# EAGLE schematic EEZ DIB AFE3 r1B1 (EAGLE 7.2.0)
2 x isolated, Hi-voltage, Hi-current
Assembly variants: Farnell, TME

## Sheet 1 of 4: Isolated Ch#1, Ch#2
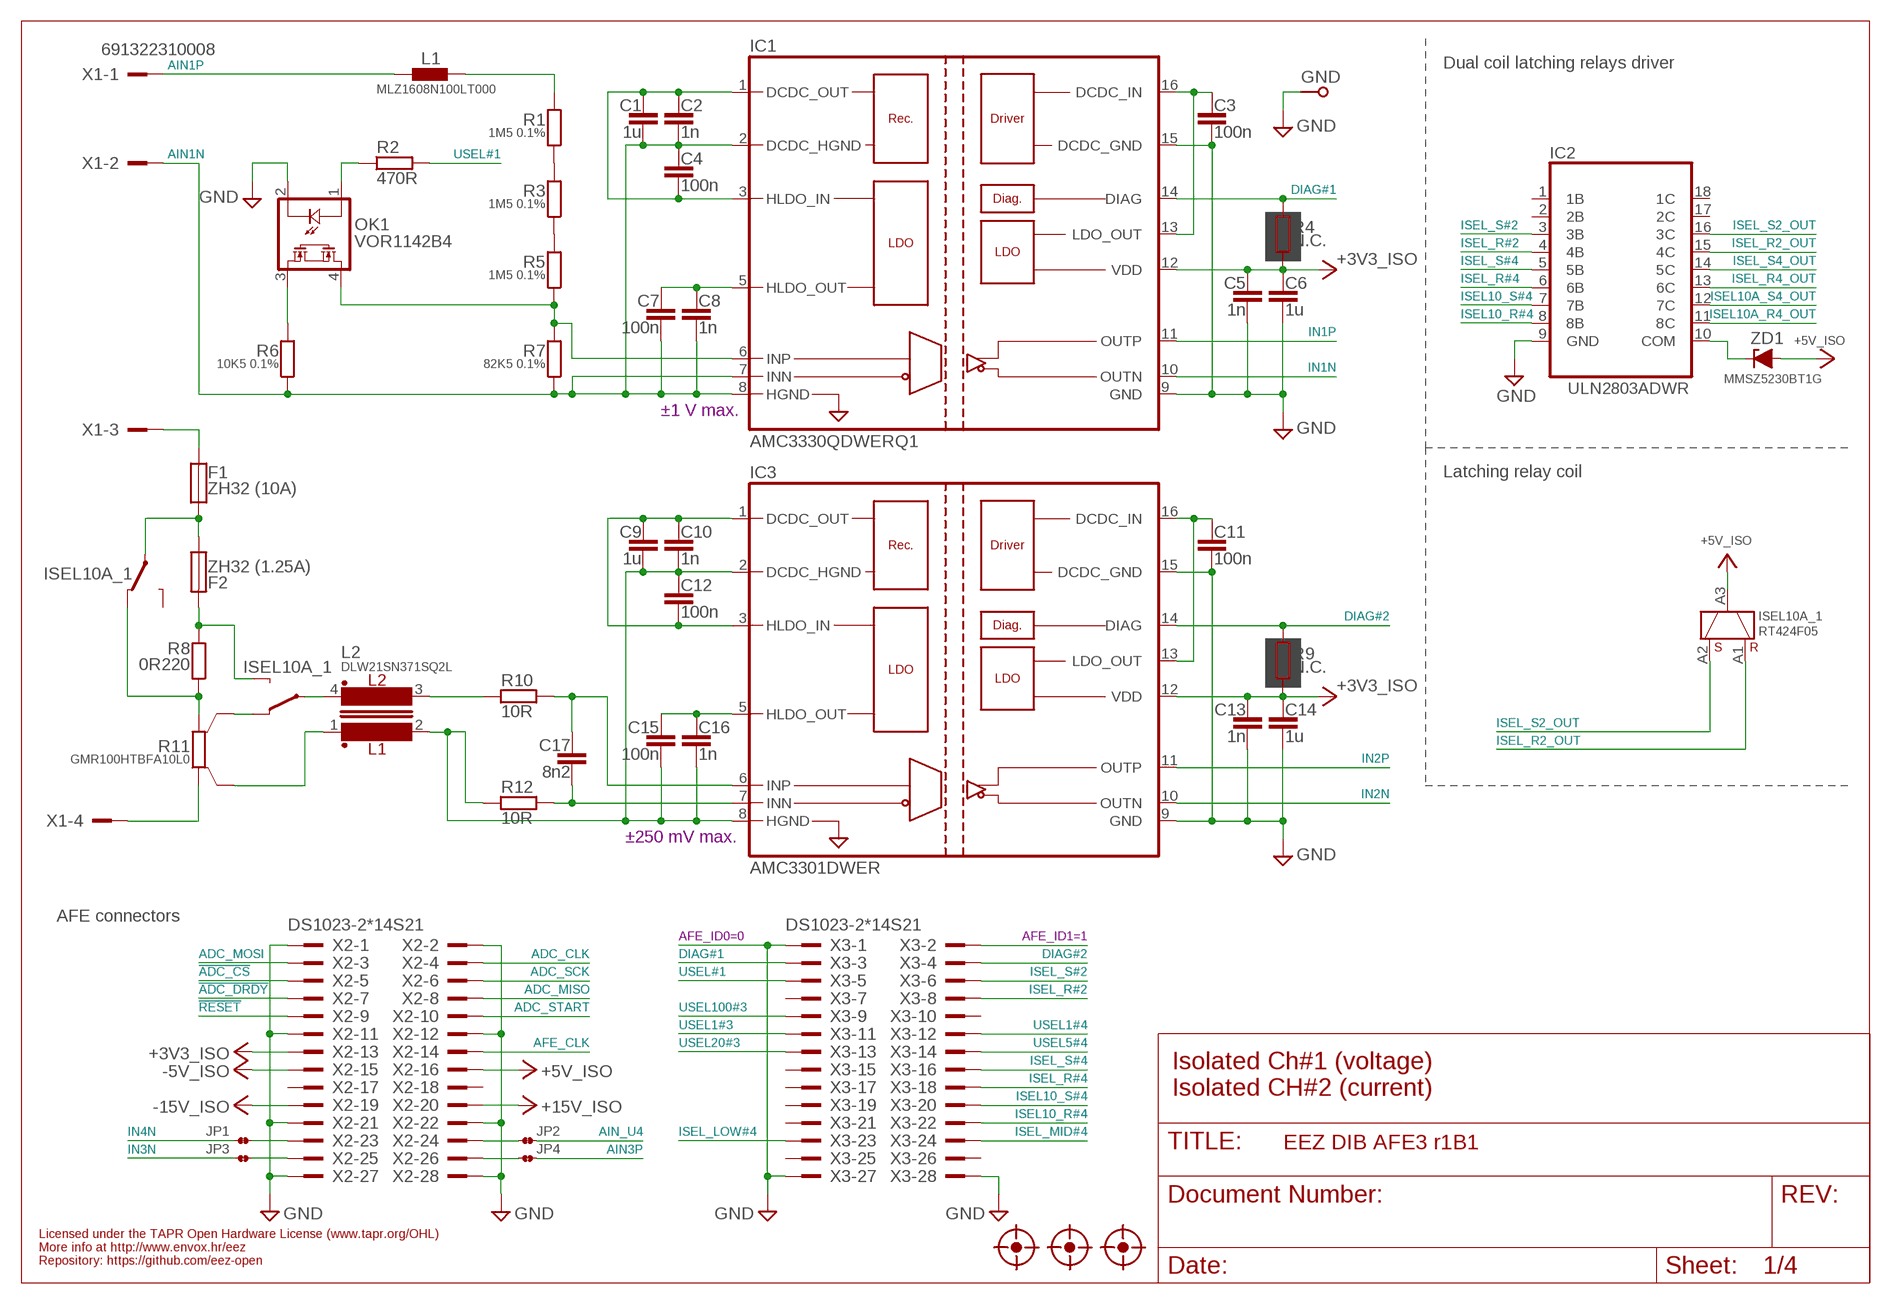
[diagram p0: schematic, sheet 1]

### Parts
C1  1u  C-EUC0603  [C0603]
C2  1n  C-EUC0603  [C0603]
C3  100n  C-EUC0603  [C0603]
C4  100n  C-EUC0603  [C0603]
C5  1n  C-EUC1206  [C1206]
C6  1u  C-EUC1206  [C1206]
C7  100n  C-EUC1206  [C1206]
C8  1n  C-EUC1206  [C1206]
C9  1u  C-EUC0603  [C0603]
C10  1n  C-EUC0603  [C0603]
C11  100n  C-EUC0603  [C0603]
C12  100n  C-EUC0603  [C0603]
C13  1n  C-EUC1206  [C1206]
C14  1u  C-EUC1206  [C1206]
C15  100n  C-EUC1206  [C1206]
C16  1n  C-EUC1206  [C1206]
C17  8n2  C-EUC0603  [C0603]
F1  ZH32 (10A)  ZH32  [ZH32]
F2  ZH32 (1.25A)  ZH32  [ZH32]
FM1  FIDUCIAL_2  [FIDUCIAL_DUAL]
FM2  FIDUCIAL_2  [FIDUCIAL_DUAL]
FM3  FIDUCIAL_2  [FIDUCIAL_DUAL]
GND  PCB_TEST_TABSHIELD  [PCB_SHIELD_TAB]
IC1  AMC3330QDWERQ1  AMC3301DWER  [DW16]
IC2  ULN2803ADWR  [DW18_TEX-M]
IC3  AMC3301DWER  [DW16]
ISEL10A_1  RT424F05  RT424FXX  [RT424FXX]
JP1  JP2-NOCUT-0805  [JP2-0805-NOCUT]
JP2  JP2-NOCUT-0805  [JP2-0805-NOCUT]
JP3  JP2-NOCUT-0805  [JP2-0805-NOCUT]
JP4  JP2-NOCUT-0805  [JP2-0805-NOCUT]
L1  MLZ1608N100LT000  FERRITE_BEAD0603  [BEAD0603]
L2  DLW21SN371SQ2L  DLW21S  [MURATA_DLW21S]
OK1  VOR1142B4  [DIL4-SMD]
R1  1M5 0.1%  R-EU_R1206  [R1206]
R2  470R  R-EU_R0805  [R0805]
R3  1M5 0.1%  R-EU_R1206  [R1206]
R4  N.C.  R-EU_R0805  [R0805]
R5  1M5 0.1%  R-EU_R1206  [R1206]
R6  10K5 0.1%  R-EU_R1206  [R1206]
R7  82K5 0.1%  R-EU_R1206  [R1206]
R8  0R220  R-EU_R1210  [R1210]
R9  N.C.  R-EU_R0805  [R0805]
R10  10R  R-EU_R0805  [R0805]
R11  GMR100HTBFA10L0  R-EU_4WIRE2512  [R_2512-4WIRE]
R12  10R  R-EU_R0805  [R0805]
X1  691322310008  [691322310008]
X2  DS1023-2*14S21  TSW-114-07-F-D  [TSW-114-07-F-D]
X3  DS1023-2*14S21  TSW-114-07-F-D  [TSW-114-07-F-D]
ZD1  MMSZ5230BT1G  ZENER-DIODESOD123  [SOD123]

### Nets
!ADC_CS: X2.5 ; also sheet 4
!ADC_DRDY: X2.7 ; also sheet 4
!RESET: X2.9 ; also sheet 4
+3V3_ISO: C5.1 C6.1 C13.1 C14.1 IC1.12(VDD) IC3.12(VDD) R4.2 R9.2 X2.13 ; also sheet 4
+5V_ISO: ISEL10A_1.A3(A:COM) X2.16 ZD1.A ; also sheet 2,3,4
+15V_ISO: X2.20 ; also sheet 2,3
-5V_ISO: X2.15 ; also sheet 4
-15V_ISO: X2.19 ; also sheet 2,3
ADC_CLK: X2.4 ; also sheet 4
ADC_MISO: X2.8 ; also sheet 4
ADC_MOSI: X2.3 ; also sheet 4
ADC_SCK: X2.6 ; also sheet 4
ADC_START: X2.10 ; also sheet 4
AFE_CLK: X2.14
AIN1N: C1.2 C2.2 C4.1 C7.2 C8.2 IC1.2(DCDC_HGND) IC1.7(INN) IC1.8(HGND) R6.1 R7.1 X1.2
AIN1P: L1.P$2 X1.1
AIN2N: R11.1 X1.4
AIN2P: F1.2 X1.3
AIN3P: JP4.2 ; also sheet 2
AIN_U4: JP2.2 ; also sheet 3
DIAG#1: IC1.14(DIAG) R4.1 X3.3
DIAG#2: IC3.14(DIAG) R9.1 X3.4
GND: C3.2 C5.2 C6.2 C11.2 C13.2 C14.2 GND.1 IC1.9(GND) IC1.15(DCDC_GND) IC2.9(GND) IC3.9(GND) IC3.15(DCDC_GND) OK1.2(C) X2.1 X2.2 X2.11 X2.12 X2.21 X2.22 X2.27 X2.28 X3.1 X3.27 X3.28 ; also sheet 2,3,4
GNDI1: C9.2 C10.2 C12.1 C15.2 C16.2 IC3.2(DCDC_HGND) IC3.8(HGND) L2.2 R12.2
IN1N: IC1.10(OUTN) ; also sheet 4
IN1P: IC1.11(OUTP) ; also sheet 4
IN2N: IC3.10(OUTN) ; also sheet 4
IN2P: IC3.11(OUTP) ; also sheet 4
IN3N: JP3.1 ; also sheet 2,4
IN4N: JP1.1 ; also sheet 3,4
ISEL10_R#4: IC2.8(8B) X3.22
ISEL10_S#4: IC2.7(7B) X3.20
ISEL10A_R4_OUT: IC2.11(8C) ; also sheet 3
ISEL10A_S4_OUT: IC2.12(7C) ; also sheet 3
ISEL_LOW#4: X3.23 ; also sheet 3
ISEL_MID#4: X3.24 ; also sheet 3
ISEL_R2_OUT: IC2.15(4C) ISEL10A_1.A1(A:R)
ISEL_R4_OUT: IC2.13(6C) ; also sheet 3
ISEL_R#2: IC2.4(4B) X3.8
ISEL_R#4: IC2.6(6B) X3.18
ISEL_S2_OUT: IC2.16(3C) ISEL10A_1.A2(A:S)
ISEL_S4_OUT: IC2.14(5C) ; also sheet 3
ISEL_S#2: IC2.3(3B) X3.6
ISEL_S#4: IC2.5(5B) X3.16
N$2: L1.P$1 R1.2
N$6: X3.2
N$15: IC1.6(INP) OK1.4(S1) R5.1 R7.2
N$16: R1.1 R3.2
N$17: R3.1 R5.2
N$18: ISEL10A_1.22(C:NC) R11.2S
N$19: ISEL10A_1.12(B:NC) R8.1 R11.2
N$20: OK1.3(S2) R6.2
N$21: C1.1 C2.1 C4.2 IC1.1(DCDC_OUT) IC1.3(HLDO_IN)
N$25: C7.1 C8.1 IC1.5(HLDO_OUT)
N$28: C3.1 IC1.13(LDO_OUT) IC1.16(DCDC_IN)
N$29: C17.1 IC3.6(INP) R10.1
N$31: C9.1 C10.1 C12.2 IC3.1(DCDC_OUT) IC3.3(HLDO_IN)
N$32: C15.1 C16.1 IC3.5(HLDO_OUT)
N$33: C11.1 IC3.13(LDO_OUT) IC3.16(DCDC_IN)
N$37: ISEL10A_1.21(C:COM) L2.4
N$44: F1.1 F2.1 ISEL10A_1.11(B:COM)
N$55: L2.1 R11.1S
N$71: F2.2 ISEL10A_1.24(C:NO) R8.2
N$73: OK1.1(A) R2.1
N$75: L2.3 R10.2
N$77: C17.2 IC3.7(INN) R12.1
N$137: IC2.10(COM) ZD1.C
N$154: JP1.2 X2.23
N$155: JP3.2 X2.25
N$156: JP2.1 X2.24
N$157: JP4.1 X2.26
USEL1#3: X3.11 ; also sheet 2
USEL1#4: X3.12 ; also sheet 3
USEL5#4: X3.14 ; also sheet 3
USEL20#3: X3.13 ; also sheet 2
USEL100#3: X3.9 ; also sheet 2
USEL#1: R2.2 X3.5
Unconnected: IC2.1(1B) IC2.2(2B) IC2.17(2C) IC2.18(1C) ISEL10A_1.14(B:NO) X2.17 X2.18 X3.7 X3.10 X3.15 X3.17 X3.19 X3.21 X3.25 X3.26

### Notes on the sheet
- Dual coil latching relays driver
- ±1 V max.
- Latching relay coil
- ±250 mV max.
- AFE connectors
- AFE_ID0=0 | AFE_ID1=1
- Isolated Ch#1 (voltage)
  Isolated CH#2 (current)
- Licensed under the TAPR Open Hardware License (www.tapr.org/OHL)
- More info at http://www.envox.hr/eez
- Repository: https://github.com/eez-open

## Sheet 2 of 4: AFE Ch#3 (hi-voltage)
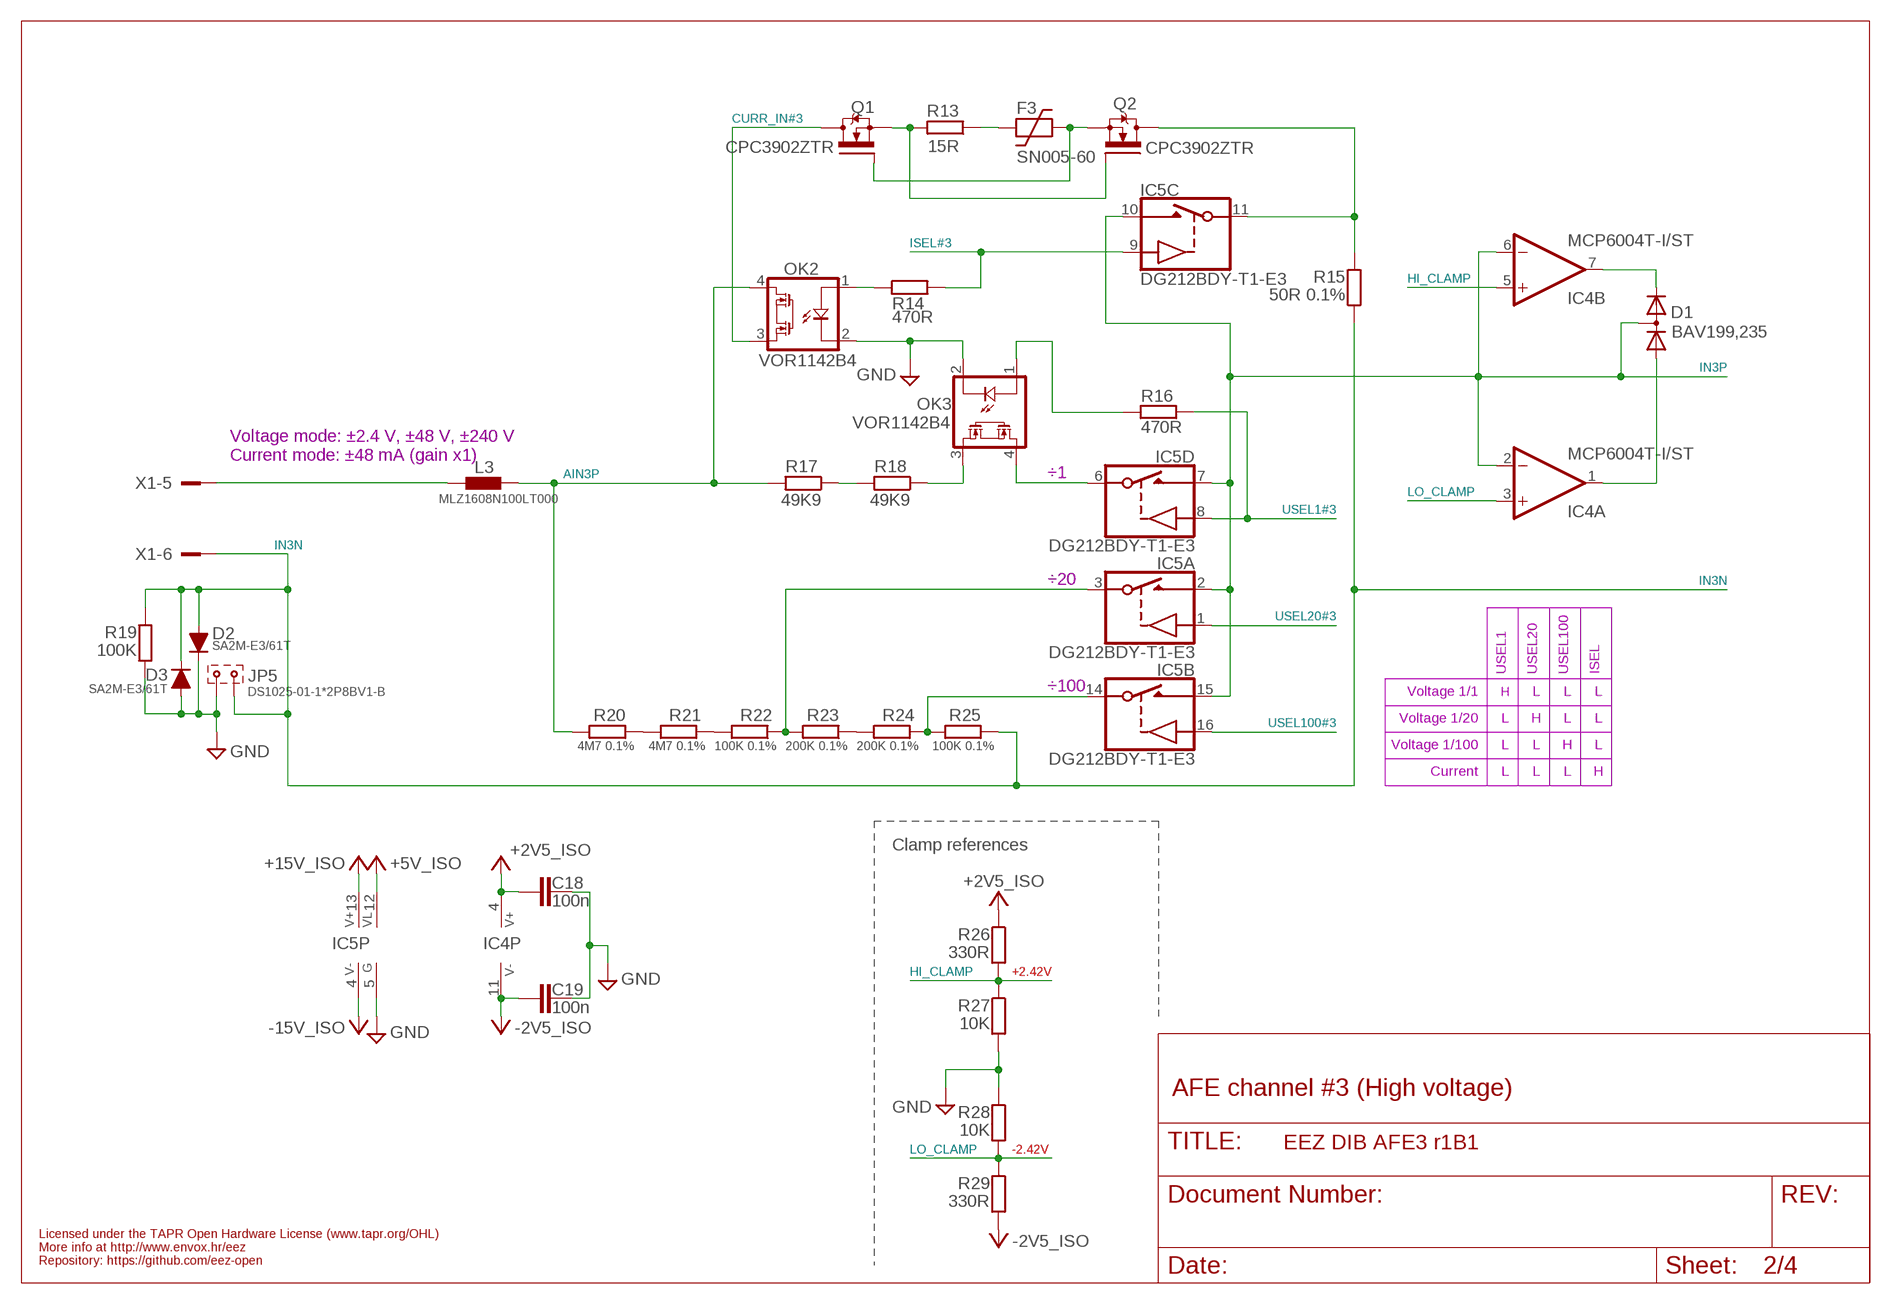
[diagram p1: schematic, sheet 2]

### Parts
C18  100n  C-EUC0603  [C0603]
C19  100n  C-EUC0603  [C0603]
D1  BAV199,235  BAV199  [SOT23]
D2  SA2M-E3/61T  DIODE_SMA-NARROW  [SMA_NARROW]
D3  SA2M-E3/61T  DIODE_SMA-NARROW  [SMA_NARROW]
F3  SN005-60  FUSE_RESETTABLE2  [C1206-HV]
IC4  MCP6004T-I/ST  OPA4197PW  [PW(R-PDSO-G14)]
IC5  DG212BDY-T1-E3  [SO16]
JP5  DS1025-01-1*2P8BV1-B  JUMPER-2PIN-2MM  [2MM-2]
L3  MLZ1608N100LT000  FERRITE_BEAD0603  [BEAD0603]
OK2  VOR1142B4  [DIL4-SMD]
OK3  VOR1142B4  [DIL4-SMD]
Q1  CPC3902ZTR  BSP129SOT-223  [SOT230P700X180-4N]
Q2  CPC3902ZTR  BSP129SOT-223  [SOT230P700X180-4N]
R13  15R  R-EU_R0805  [R0805]
R14  470R  R-EU_R0805  [R0805]
R15  50R 0.1%  R-EU_R1206  [R1206]
R16  470R  R-EU_R0805  [R0805]
R17  49K9  R-EU_R1206  [R1206]
R18  49K9  R-EU_R1206  [R1206]
R19  100K  R-EU_R1206  [R1206]
R20  4M7 0.1%  R-EU_R1206  [R1206]
R21  4M7 0.1%  R-EU_R1206  [R1206]
R22  100K 0.1%  R-EU_R1206  [R1206]
R23  200K 0.1%  R-EU_R1206  [R1206]
R24  200K 0.1%  R-EU_R1206  [R1206]
R25  100K 0.1%  R-EU_R1206  [R1206]
R26  330R  R-EU_R0805  [R0805]
R27  10K  R-EU_R0805  [R0805]
R28  10K  R-EU_R0805  [R0805]
R29  330R  R-EU_R0805  [R0805]

### Nets
+2V5_ISO: C18.2 IC4.4(P:V+) R26.1 ; also sheet 3,4
+5V_ISO: IC5.12(P:VL) ; also sheet 1,3,4
+15V_ISO: IC5.13(P:V+) ; also sheet 1,3
-2V5_ISO: C19.2 IC4.11(P:V-) R29.2 ; also sheet 3,4
-15V_ISO: IC5.4(P:V-) ; also sheet 1,3
AIN3P: L3.P$1 OK2.4(S1) R17.2 R20.2 ; also sheet 1
CURR#3: IC5.11(C:S) Q2.2(D) Q2.4(D) R15.2
CURR_IN#3: OK2.3(S2) Q1.2(D) Q1.4(D)
GND: C18.1 C19.1 D2.1(C) D3.2(A) IC5.5(P:GND) JP5.2 OK2.2(C) OK3.2(C) R19.1 R27.2 R28.1 ; also sheet 1,3,4
HI_CLAMP: IC4.5(B:+IN) R26.2 R27.1 ; also sheet 3
IN3N: D2.2(A) D3.1(C) JP5.1 R15.1 R19.2 R25.1 X1.6 ; also sheet 1,4
IN3P: D1.3(AC) IC4.2(A:-IN) IC4.6(B:-IN) IC5.2(A:D) IC5.7(D:D) IC5.10(C:D) IC5.15(B:D) ; also sheet 4
ISEL#3: IC5.9(C:IN) R14.2
LO_CLAMP: IC4.3(A:+IN) R28.2 R29.1 ; also sheet 3
N$13: L3.P$2 X1.5
N$56: IC5.14(B:S) R24.1 R25.2
N$57: IC5.6(D:S) OK3.4(S1)
N$58: OK3.3(S2) R18.1
N$59: D1.2(C) IC4.7(B:OUT)
N$60: D1.1(A) IC4.1(A:OUT)
N$61: R17.1 R18.2
N$62: IC5.3(A:S) R22.1 R23.2
N$63: R23.1 R24.2
N$64: R21.1 R22.2
N$65: R20.1 R21.2
N$66: OK2.1(A) R14.1
N$67: OK3.1(A) R16.2
N$68: F3.2 Q1.1(G) Q2.3(S)
N$69: Q1.3(S) Q2.1(G) R13.2
N$72: F3.1 R13.1
USEL1#3: IC5.8(D:IN) R16.1 ; also sheet 1
USEL20#3: IC5.1(A:IN) ; also sheet 1
USEL100#3: IC5.16(B:IN) ; also sheet 1

### Notes on the sheet
- Voltage mode: ±2.4 V, ±48 V, ±240 V
  Current mode: ±48 mA (gain x1)
- ÷1
- ÷20
- USEL1 | USEL20 | USEL100 | ISEL
- ÷100
- Voltage 1/1 | H | L | L | L
- Voltage 1/20 | L | H | L | L
- Voltage 1/100 | L | L | H | L
- Current | L | L | L | H
- Clamp references
- +2.42V
- AFE channel #3 (High voltage)
- -2.42V
- Licensed under the TAPR Open Hardware License (www.tapr.org/OHL)
- More info at http://www.envox.hr/eez
- Repository: https://github.com/eez-open

## Sheet 3 of 4: AFE Ch#4 (Hi-current)
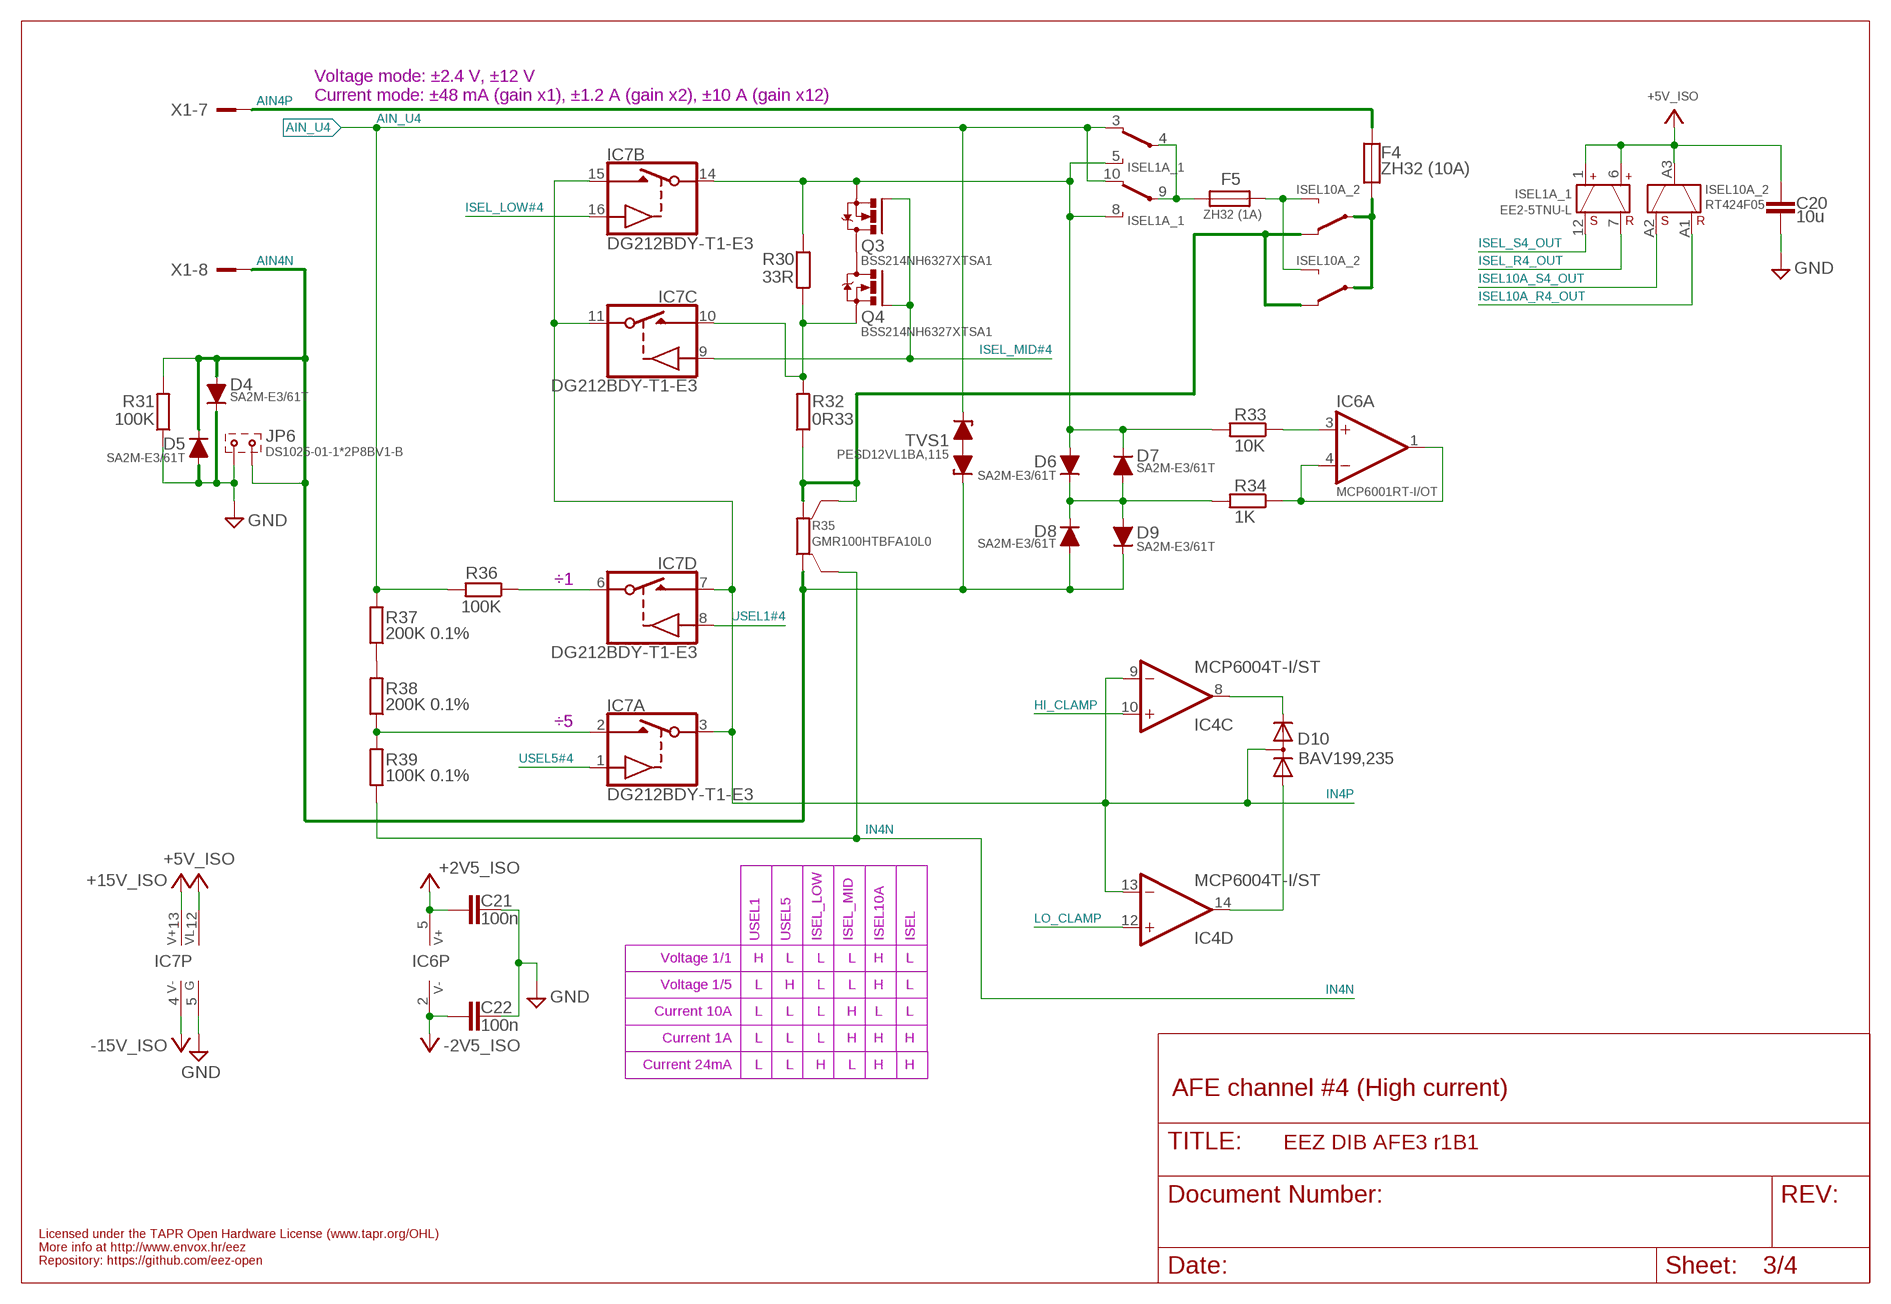
[diagram p2: schematic, sheet 3]

### Parts
C20  10u  C-EUC1206  [C1206]
C21  100n  C-EUC0603  [C0603]
C22  100n  C-EUC0603  [C0603]
D4  SA2M-E3/61T  DIODE_SMA-NARROW  [SMA_NARROW]
D5  SA2M-E3/61T  DIODE_SMA-NARROW  [SMA_NARROW]
D6  SA2M-E3/61T  DIODE_SMA-NARROW  [SMA_NARROW]
D7  SA2M-E3/61T  DIODE_SMA-NARROW  [SMA_NARROW]
D8  SA2M-E3/61T  DIODE_SMA-NARROW  [SMA_NARROW]
D9  SA2M-E3/61T  DIODE_SMA-NARROW  [SMA_NARROW]
D10  BAV199,235  BAV199  [SOT23]
F4  ZH32 (10A)  ZH32  [ZH32]
F5  ZH32 (1A)  ZH32  [ZH32]
IC6  MCP6001RT-I/OT  OPA376AIDBVR  [DBV5]
IC7  DG212BDY-T1-E3  [SO16]
ISEL1A_1  EE2-5TNU-L  G6SK-2F  [G6SK-2F]
ISEL10A_2  RT424F05  RT424FXX  [RT424FXX]
JP6  DS1025-01-1*2P8BV1-B  JUMPER-2PIN-2MM  [2MM-2]
Q3  BSS214NH6327XTSA1  2N7002  [SOT103P240X110-3N]
Q4  BSS214NH6327XTSA1  2N7002  [SOT103P240X110-3N]
R30  33R  R-EU_R1206  [R1206]
R31  100K  R-EU_R1206  [R1206]
R32  0R33  R-EU_R1210  [R1210]
R33  10K  R-EU_R0805  [R0805]
R34  1K  R-EU_R0805  [R0805]
R35  GMR100HTBFA10L0  R-EU_4WIRE2512  [R_2512-4WIRE]
R36  100K  R-EU_R1206  [R1206]
R37  200K 0.1%  R-EU_R1206  [R1206]
R38  200K 0.1%  R-EU_R1206  [R1206]
R39  100K 0.1%  R-EU_R1206  [R1206]
TVS1  PESD12VL1BA,115  PESDXL1BA  [SOD323-BIDIR]

### Nets
+2V5_ISO: C21.2 IC6.5(P:V+) ; also sheet 2,4
+5V_ISO: C20.1 IC7.12(P:VL) ISEL1A_1.1(A:S+) ISEL1A_1.6(A:R+) ISEL10A_2.A3(A:COM) ; also sheet 1,2,4
+15V_ISO: IC7.13(P:V+) ; also sheet 1,2
-2V5_ISO: C22.2 IC6.2(P:V-) ; also sheet 2,4
-15V_ISO: IC7.4(P:V-) ; also sheet 1,2
AIN4N: D4.2(A) D5.1(C) D8.2(A) D9.1(C) JP6.1 R31.2 R35.1 TVS1.C1 X1.8
AIN4P: F4.2 X1.7
AIN4P_FUSED: F5.1 ISEL1A_1.4(B:COM) ISEL1A_1.9(C:COM)
AIN_U4: ISEL1A_1.3(B:NC) ISEL1A_1.10(C:NC) R36.2 R37.2 TVS1.C2 ; also sheet 1
GND: C20.2 C21.1 C22.1 D4.1(C) D5.2(A) IC7.5(P:GND) JP6.2 R31.1 ; also sheet 1,2,4
HI_CLAMP: IC4.10(C:+IN) ; also sheet 2
HI_CURR#1: ISEL10A_2.12(B:NC) ISEL10A_2.22(C:NC) R32.1 R35.2 R35.2S
IN4N: R35.1S R39.1 ; also sheet 1,4
IN4P: D10.3(AC) IC4.9(C:-IN) IC4.13(D:-IN) IC7.3(A:S) IC7.7(D:D) IC7.11(C:S) IC7.15(B:D) ; also sheet 4
ISEL10A_R4_OUT: ISEL10A_2.A1(A:R) ; also sheet 1
ISEL10A_S4_OUT: ISEL10A_2.A2(A:S) ; also sheet 1
ISEL_LOW#4: IC7.16(B:IN) ; also sheet 1
ISEL_MID#4: IC7.9(C:IN) Q3.1(G) Q4.1(G) ; also sheet 1
ISEL_R4_OUT: ISEL1A_1.7(A:R-) ; also sheet 1
ISEL_S4_OUT: ISEL1A_1.12(A:S-) ; also sheet 1
LO_CLAMP: IC4.12(D:+IN) ; also sheet 2
N$30: F4.1 ISEL10A_2.11(B:COM) ISEL10A_2.21(C:COM)
N$81: Q3.3(D) Q4.3(D)
N$141: F5.2 ISEL10A_2.14(B:NO) ISEL10A_2.24(C:NO)
N$170: IC7.10(C:D) Q4.2(S) R30.1 R32.2
N$173: D6.1(C) D7.2(A) D8.1(C) D9.2(A) R34.2
N$182: D6.2(A) D7.1(C) IC7.14(B:S) ISEL1A_1.5(B:NO) ISEL1A_1.8(C:NO) Q3.2(S) R30.2 R33.2
N$183: IC6.1(A:OUT) IC6.4(A:-IN) R34.1
N$184: IC6.3(A:+IN) R33.1
N$187: R37.1 R38.2
N$189: IC7.2(A:D) R38.1 R39.2
N$192: IC7.6(D:S) R36.1
N$199: D10.2(C) IC4.8(C:OUT)
N$200: D10.1(A) IC4.14(D:OUT)
USEL1#4: IC7.8(D:IN) ; also sheet 1
USEL5#4: IC7.1(A:IN) ; also sheet 1

### Notes on the sheet
- Voltage mode: ±2.4 V, ±12 V
  Current mode: ±48 mA (gain x1), ±1.2 A (gain x2), ±10 A (gain x12)
- ÷1
- ÷5
- USEL1 | USEL5 | ISEL_LOW | ISEL_MID | ISEL10A | ISEL
- Voltage 1/1 | H | L | L | L | H | L
- Voltage 1/5 | L | H | L | L | H | L
- Current 10A | L | L | L | H | L | L
- Current 1A | L | L | L | H | H | H
- Current 24mA | L | L | H | L | H | H
- AFE channel #4 (High current)
- Licensed under the TAPR Open Hardware License (www.tapr.org/OHL)
- More info at http://www.envox.hr/eez
- Repository: https://github.com/eez-open

## Sheet 4 of 4: Voltage/current ADC
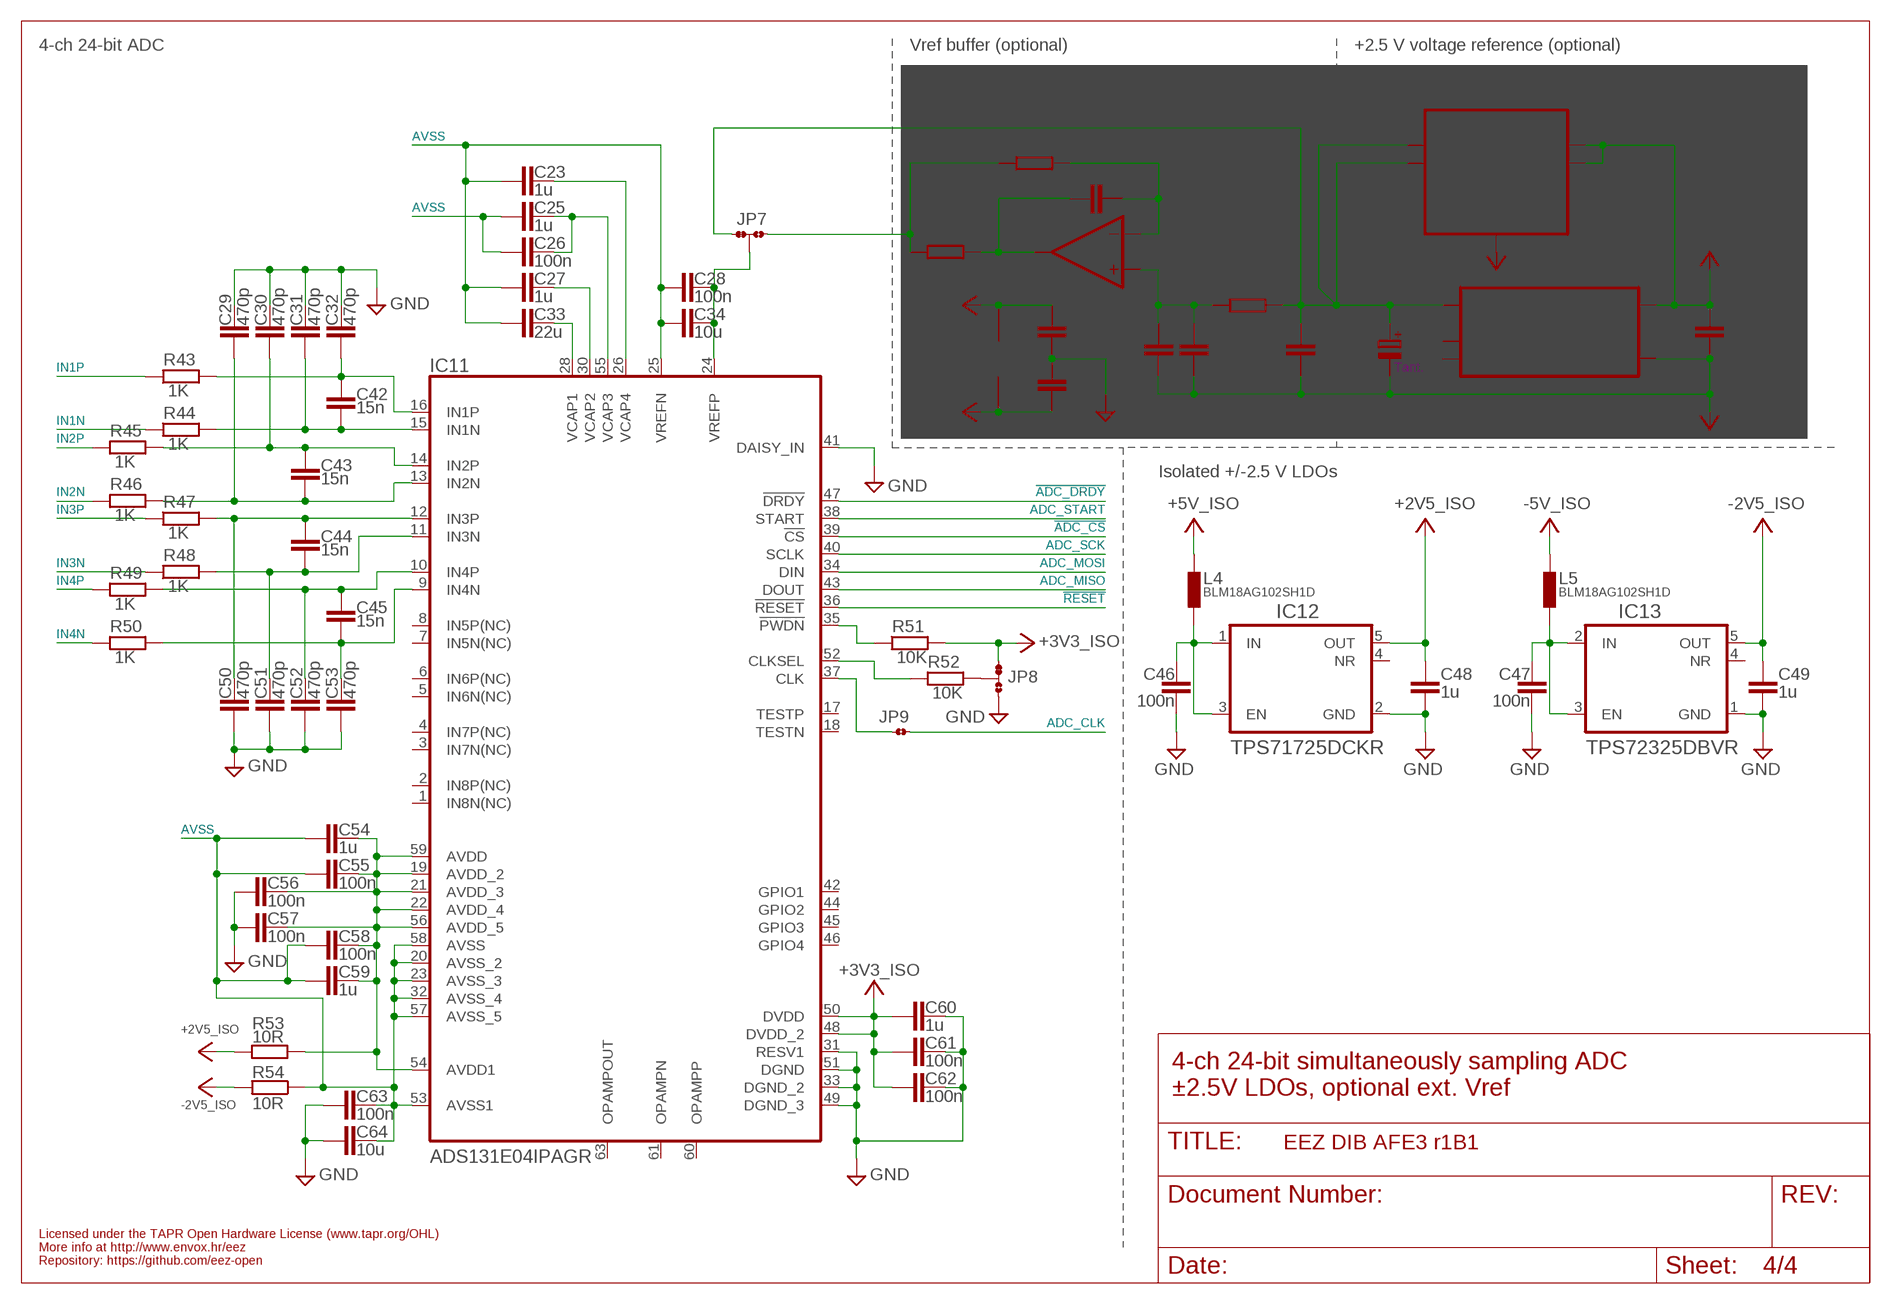
[diagram p3: schematic, sheet 4]

### Parts
C23  1u  C-EUC0805  [C0805]
C24  N.C.  C-EUC0805  [C0805]
C25  1u  C-EUC0805  [C0805]
C26  100n  C-EUC0603  [C0603]
C27  1u  C-EUC0805  [C0805]
C28  100n  C-EUC0603  [C0603]
C29  470p  C-EUC0603  [C0603]
C30  470p  C-EUC0603  [C0603]
C31  470p  C-EUC0603  [C0603]
C32  470p  C-EUC0603  [C0603]
C33  22u  C-EUC1206  [C1206]
C34  10u  C-EUC1206  [C1206]
C35  N.C.  C-EUC0603  [C0603]
C36  N.C.  C-EUC1206  [C1206]
C37  N.C.  C-EUC1206  [C1206]
C38  N.C.  C-EUC1206  [C1206]
C39  N.C.  C-EUC1206  [C1206]
C40  N.C.  ECAP1206  [EC1206]
C41  N.C.  C-EUC0603  [C0603]
C42  15n  C-EUC0603  [C0603]
C43  15n  C-EUC0603  [C0603]
C44  15n  C-EUC0603  [C0603]
C45  15n  C-EUC0603  [C0603]
C46  100n  C-EUC0603  [C0603]
C47  100n  C-EUC0603  [C0603]
C48  1u  C-EUC0805  [C0805]
C49  1u  C-EUC0805  [C0805]
C50  470p  C-EUC0603  [C0603]
C51  470p  C-EUC0603  [C0603]
C52  470p  C-EUC0603  [C0603]
C53  470p  C-EUC0603  [C0603]
C54  1u  C-EUC0805  [C0805]
C55  100n  C-EUC0603  [C0603]
C56  100n  C-EUC0603  [C0603]
C57  100n  C-EUC0603  [C0603]
C58  100n  C-EUC0603  [C0603]
C59  1u  C-EUC0805  [C0805]
C60  1u  C-EUC0805  [C0805]
C61  100n  C-EUC0603  [C0603]
C62  100n  C-EUC0603  [C0603]
C63  100n  C-EUC0603  [C0603]
C64  10u  C-EUC1206  [C1206]
IC8  N.C.  LTC6655BHMS8  [MSOP-8_MS_LIT]
IC9  N.C.  OPA376AIDBVR  [DBV5]
IC10  N.C.  REF50XX  [SOIC127P600X175-8N]
IC11  ADS131E04IPAGR  ADS131E0XIPAG  [PAG64]
IC12  TPS71725DCKR  [DCK5]
IC13  TPS72325DBVR  [DBV5]
JP7  JP3-CUT-0805-ROTATED  [JP3-0805-CUT2]
JP8  JP3-CUT-0805-ROTATED  [JP3-0805-CUT2]
JP9  JP2-CUT-0805  [R_0805]
L4  BLM18AG102SH1D  FERRITE_BEAD0603  [BEAD0603]
L5  BLM18AG102SH1D  FERRITE_BEAD0603  [BEAD0603]
R40  N.C.  R-EU_R0805  [R0805]
R41  N.C.  R-EU_R0805  [R0805]
R42  N.C.  R-EU_R0805  [R0805]
R43  1K  R-EU_R0805  [R0805]
R44  1K  R-EU_R0805  [R0805]
R45  1K  R-EU_R0805  [R0805]
R46  1K  R-EU_R0805  [R0805]
R47  1K  R-EU_R0805  [R0805]
R48  1K  R-EU_R0805  [R0805]
R49  1K  R-EU_R0805  [R0805]
R50  1K  R-EU_R0805  [R0805]
R51  10K  R-EU_R0805  [R0805]
R52  10K  R-EU_R0805  [R0805]
R53  10R  R-EU_R0805  [R0805]
R54  10R  R-EU_R0805  [R0805]

### Nets
!ADC_CS: IC11.39(!CS) ; also sheet 1
!ADC_DRDY: IC11.47(!DRDY) ; also sheet 1
!RESET: IC11.36(!RESET) ; also sheet 1
+2V5_ADC: C54.2 C55.1 C56.1 C57.1 C58.1 C59.2 IC11.19(AVDD_2) IC11.21(AVDD_3) IC11.22(AVDD_4) IC11.54(AVDD1) IC11.56(AVDD_5) IC11.59(AVDD) R53.2
+2V5_ISO: C48.2 IC12.5(OUT) R53.1 ; also sheet 2,3
+3V3_ISO: C60.1 C61.2 C62.2 IC11.48(DVDD_2) IC11.50(DVDD) JP8.NC R51.2 ; also sheet 1
+5V_ISO: C35.1 C36.1 IC8.1(!SHDN) IC8.2(VIN) IC9.5(P:V+) IC10.2(VIN) L4.P$2 ; also sheet 1,2,3
-2V5_ISO: C36.2 C37.2 C38.2 C39.2 C40.- C49.2 IC8.3(GND) IC8.4(GND) IC8.5(GND) IC8.8(GND) IC10.4(GND) IC13.5(OUT) R54.2 ; also sheet 2,3
-5V_ISO: C41.2 IC9.2(P:V-) L5.P$2 ; also sheet 1
ADC_CLK: JP9.1 ; also sheet 1
ADC_MISO: IC11.43(DOUT) ; also sheet 1
ADC_MOSI: IC11.34(DIN) ; also sheet 1
ADC_SCK: IC11.40(SCLK) ; also sheet 1
ADC_START: IC11.38(START) ; also sheet 1
AVSS: C23.1 C25.1 C26.2 C27.1 C28.2 C33.1 C34.2 C54.1 C55.2 C58.2 C59.1 C63.1 C64.1 IC11.20(AVSS_2) IC11.23(AVSS_3) IC11.25(VREFN) IC11.32(AVSS_4) IC11.53(AVSS1) IC11.57(AVSS_5) IC11.58(AVSS) R54.1
GND: C29.1 C30.1 C31.1 C32.1 C35.2 C41.1 C46.2 C47.2 C48.1 C49.1 C50.1 C51.1 C52.1 C53.1 C56.2 C57.2 C60.2 C61.1 C62.1 C63.2 C64.2 IC11.31(RESV1) IC11.33(DGND_2) IC11.41(DAISY_IN) IC11.49(DGND_3) IC11.51(DGND) IC12.2(GND) IC13.1(GND) JP8.NO ; also sheet 1,2,3
IN1+: C32.2 C42.2 IC11.16(IN1P) R43.2
IN1-: C31.2 C42.1 IC11.15(IN1N) R44.2
IN1N: R44.1 ; also sheet 1
IN1P: R43.1 ; also sheet 1
IN2+: C30.2 C43.2 IC11.14(IN2P) R45.2
IN2-: C29.2 C43.1 IC11.13(IN2N) R46.2
IN2N: R46.1 ; also sheet 1
IN2P: R45.1 ; also sheet 1
IN3+: C44.2 C50.2 IC11.12(IN3P) R47.2
IN3-: C44.1 C51.2 IC11.11(IN3N) R48.2
IN3N: R48.1 ; also sheet 1,2
IN3P: R47.1 ; also sheet 2
IN4+: C45.2 C52.2 IC11.10(IN4P) R49.2
IN4-: C45.1 C53.2 IC11.9(IN4N) R50.2
IN4N: R50.1 ; also sheet 1,3
IN4P: R49.1 ; also sheet 3
N$1: IC11.52(CLKSEL) R52.1
N$3: C46.1 IC12.1(IN) IC12.3(EN) L4.P$1
N$9: C47.1 IC13.2(IN) IC13.3(EN) L5.P$1
N$14: JP8.COM R52.2
N$92: C33.2 IC11.28(VCAP1)
N$93: C27.2 IC11.30(VCAP2)
N$94: C25.2 C26.1 IC11.55(VCAP3)
N$95: C23.2 IC11.26(VCAP4)
N$96: IC11.37(CLK) JP9.2
N$98: IC11.35(!PWDN) R51.1
N$100: C39.1 C40.+ IC8.6(VOUT_S) IC8.7(VOUT_F) IC10.6(VOUT) JP7.NC R42.2
N$101: C37.1 C38.1 IC9.3(A:+IN) R42.1
N$102: C24.2 IC9.4(A:-IN) R40.2
N$103: C24.1 IC9.1(A:OUT) R41.2
N$104: JP7.NO R40.1 R41.1
VREFP: C28.1 C34.1 IC11.24(VREFP) JP7.COM
Unconnected: IC10.3(TEMP) IC10.5(TRIM/NR) IC11.1(IN8N(NC)) IC11.2(IN8P(NC)) IC11.3(IN7N(NC)) IC11.4(IN7P(NC)) IC11.5(IN6N(NC)) IC11.6(IN6P(NC)) IC11.7(IN5N(NC)) IC11.8(IN5P(NC)) IC11.17(TESTP) IC11.18(TESTN) IC11.42(GPIO1) IC11.44(GPIO2) IC11.45(GPIO3) IC11.46(GPIO4) IC11.60(OPAMPP) IC11.61(OPAMPN) IC11.63(OPAMPOUT) IC12.4(NR) IC13.4(NR)

### Notes on the sheet
- 4-ch 24-bit ADC | Vref buffer (optional) | +2.5 V voltage reference (optional)
- Tant.
- Isolated +/-2.5 V LDOs
- 4-ch 24-bit simultaneously sampling ADC
  ±2.5V LDOs, optional ext. Vref
- Licensed under the TAPR Open Hardware License (www.tapr.org/OHL)
- More info at http://www.envox.hr/eez
- Repository: https://github.com/eez-open

## Library data of the parts
C1-C39 C41-C64 = rcl:C-EU: CAPACITOR, European symbol
C40 = EEZ_Lib1:ECAP
D1 D10 = diode:BAV199: DIODE low-leakage double diode
D2-D9 = EEZ_DIB:DIODE
F1 F2 F4 F5 = EEZ_Lib1:ZH32: Fuse holder with cover; tube fuses; 5x20mm
F3 = EEZ_Lib1:FUSE_RESETTABLE2
FM1-FM3 = EEZ_Lib1:FIDUCIAL: Fiducial mark for pick and place automation
GND = EEZ_Lib1:PCB_TEST_TAB
IC1 IC3 = EEZ_TI:AMC3301: Precision, ±250-mV Input, Reinforced Isolated Amplifier With Integrated DC/DC Converter
IC2 = EEZ_TI:ULN2803A: 8 Darlington Transistor Array (500mA, 50V)
IC4 = EEZ_TI:OPA4197: Precision, Rail-to-Rail Input/Output, Low Offset Voltage, Operational Amplifiers
IC5 IC7 = EEZ_DIB:DG212B: Improved Quad CMOS Analog Switches
IC6 IC9 = EEZ_TI:OPA376A: Low-Noise, Low Quiescent Current, Precision Operational Amplifier
IC8 = EEZ_DIB:LTC6655: 0.25ppm Noise, Low Drift Precision References
IC10 = EEZ_TI:REF50XX: Low-Noise (3μVpp/V), Very Low Drift (max. 8ppm/°C), Precision Voltage Reference Pin compatible with REF2 Farnell: 1439628
IC11 = EEZ_TI:ADS131E0X: 16- / 24-bit up to 64-kSPS, 6-channel simultaneous-sampling delta-sigma ADC for power monitoring and protection
IC12 = EEZ_TI:TPS71725: Low-Noise, High-Bandwidth PSRR, Low-Dropout, 150-mA Linear Regulator
IC13 = EEZ_TI:TPS72325: 200mA Low-Noise, High-PSRR Negative Output Low-Dropout Linear Regulators
ISEL1A_1 = EEZ_switches:G6SK-2F: Double-winding Latching double-pole signal switching Relay
ISEL10A_1 ISEL10A_2 = EEZ_switches:RT424FXX: Power PCB Relay RT2 bistable (dual coil)
JP1-JP4 = EEZ_Lib1:JP2-NOCUT
JP5 JP6 = EEZ_Lib1:JUMPER-2PIN
JP7 JP8 = EEZ_Lib1:JP3-CUT
JP9 = EEZ_Lib1:JP2-CUT
L1 L3-L5 = EEZ_Lib1:FERRITE_BEAD: FAIR-RITE - 2506033007Y3 - FERRITE BEAD, 0.04OHM, 3A, 0603 Farnell: 2112873
L2 = EEZ_inductors_and_transformers:DLW21S: Murata 0805 Common mode choke coil/Common mode noise filter
OK1-OK3 = EEZ_DIB:VOR1142B4
Q1 Q2 = EEZ_Lib1:BSP129: N-channel depletion mode MOSFET
Q3 Q4 = EEZ_Lib1:2N7002: N-CHANNEL ENHANCEMENT MODE FIELD EFFECT TRANSISTOR; MPN: 2N7002-7-F; OC_FARNELL: 1713823; OC_NEWARK: 25R5679; PACKAGE: SOT-23-3; SUPPLIER: DIODES INC.
R1-R10 R12-R34 R36-R54 = rcl:R-EU_: RESISTOR, European symbol
R11 R35 = EEZ_Lib1:R-EU_4WIRE
TVS1 = EEZ_Lib1:PESDXL1BA: Low capacitance bidirectional ESD protection diodes
X1 = EEZ_connectors:691322310008: WR-TBL Serie 322 - 3.81mm Vertical PCB Header, 8 Pins
X2 X3 = EEZ_connectors:TSW-114-07-F-D: Samtec TSW Header, 2.54MM, THT, 28-way
ZD1 = EEZ_Lib1:ZENER-DIODE

## Net classes
0 default: width 0.152 mm, drill 0.3 mm, clearance 0.152 mm
1 lvds: width 0.152 mm, drill 0.3 mm, clearance 0.152 mm to class 0, clearance 0.152 mm
2 gnd: width 0.254 mm, drill 0.584 mm, clearance 0.254 mm
3 diff_in: width 0.254 mm, drill 0.584 mm, clearance 0.203 mm to class 0, clearance 0.203 mm to class 1, clearance 0.203 mm to class 2, clearance 0.203 mm